# EAGLE design edge-connector-hack (EAGLE 9.4.1)
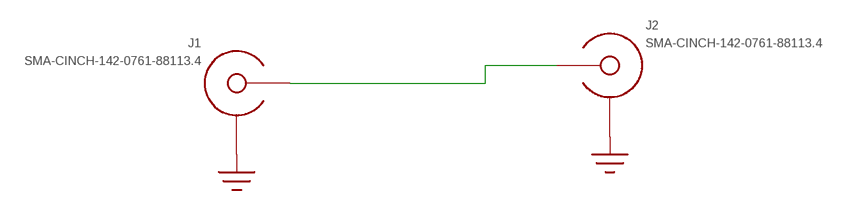
[diagram p0: schematic, sheet 1]

## Parts
J1  SMA-CINCH-142-0761-88113.4  [SMA-CINCH-142-0761-881-13.4]
J2  SMA-CINCH-142-0761-88113.4  [SMA-CINCH-142-0761-881-13.4]

## Nets
GND: J1.GND@1(SHIELD) J1.GND@2(SHIELD) J1.GND@3(SHIELD) J1.HOLE@1(SHIELD) J1.HOLE@2(SHIELD) J1.HOLE@3(SHIELD) J1.HOLE@4(SHIELD) J1.VIA@1(SHIELD) J1.VIA@2(SHIELD) J1.VIA@3(SHIELD) J1.VIA@4(SHIELD) J1.VIA@5(SHIELD) J1.VIA@6(SHIELD) J2.GND@1(SHIELD) J2.GND@2(SHIELD) J2.GND@3(SHIELD) J2.HOLE@1(SHIELD) J2.HOLE@2(SHIELD) J2.HOLE@3(SHIELD) J2.HOLE@4(SHIELD) J2.VIA@1(SHIELD) J2.VIA@2(SHIELD) J2.VIA@3(SHIELD) J2.VIA@4(SHIELD) J2.VIA@5(SHIELD) J2.VIA@6(SHIELD)
N$1 [13.6-6]: J1.CENTER J2.CENTER

## Library data of the parts
J1 J2 = yapo:SMA-CINCH-142-0761-881

## Net classes
1 13.6-6: width 0.345 mm, clearance 0.152 mm

## Board
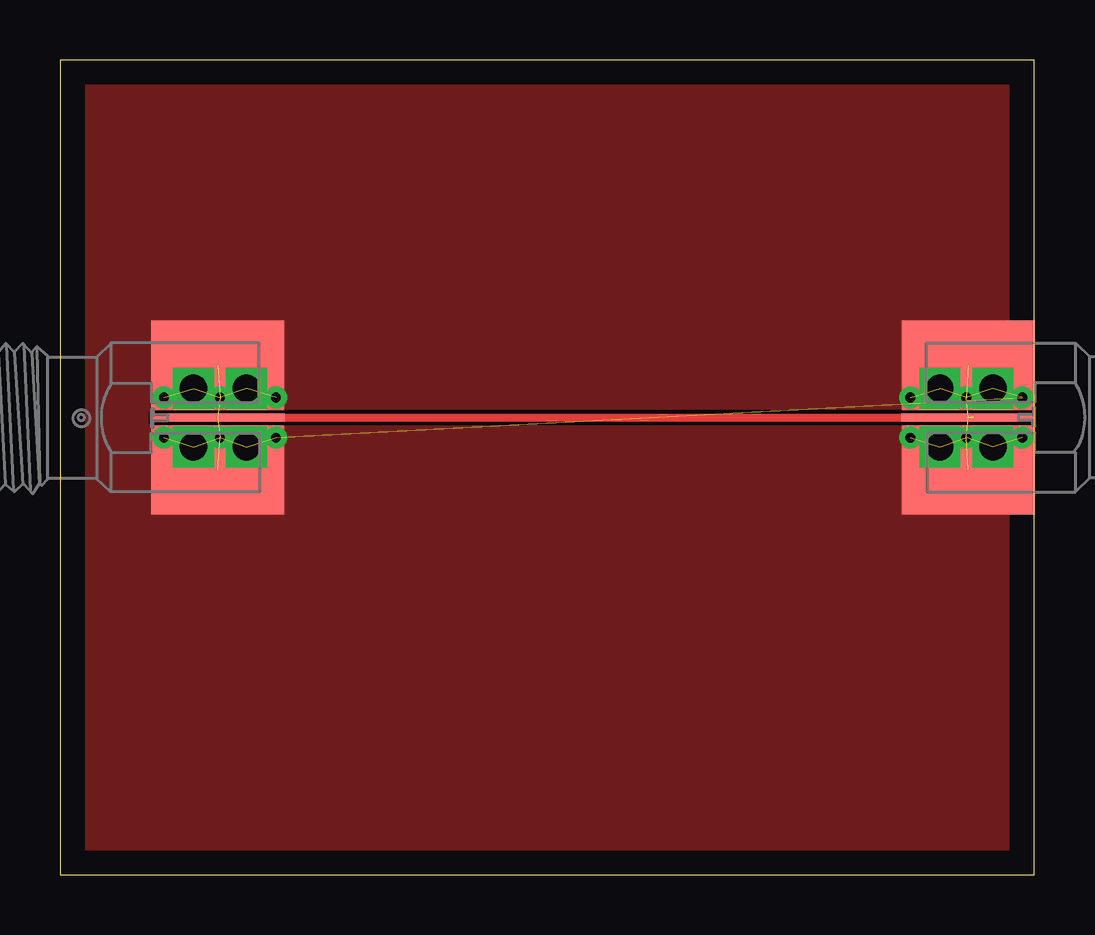
[diagram p1: board, top side]
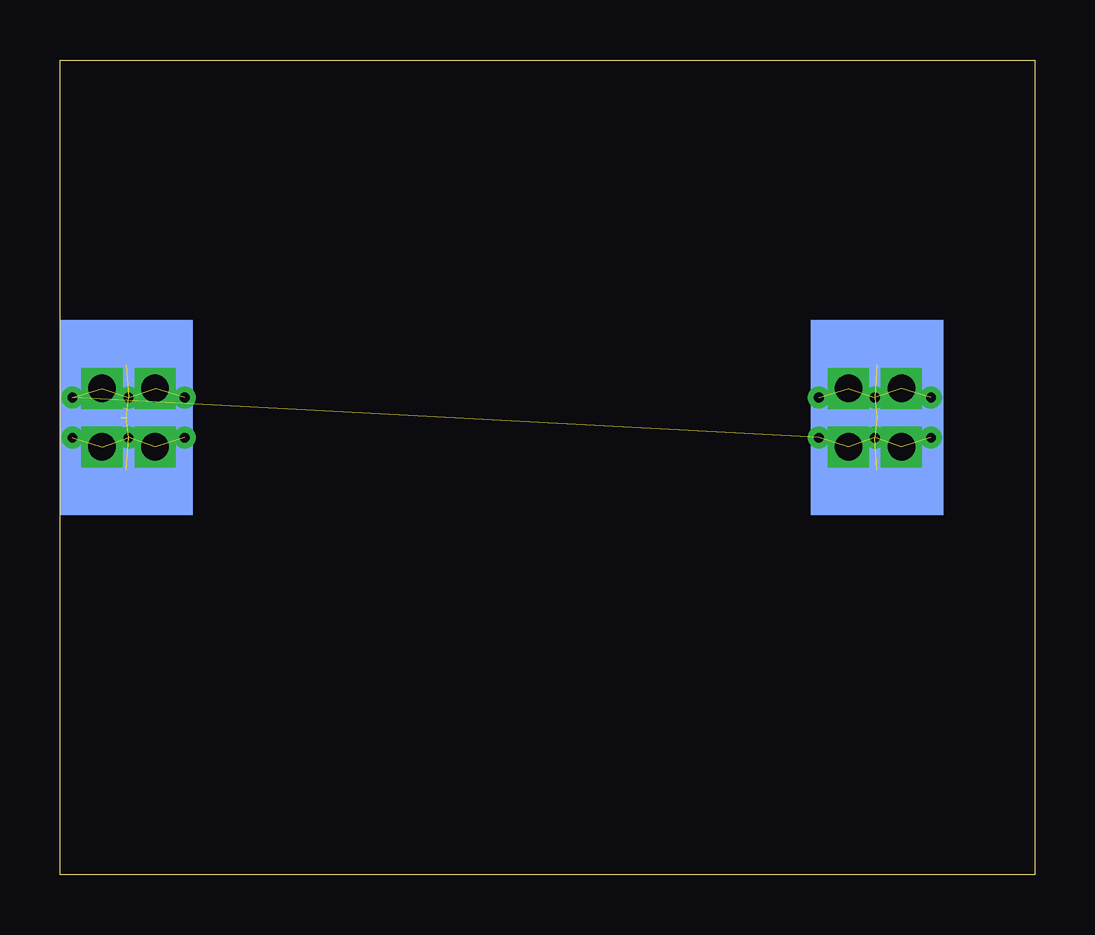
[diagram p2: board, bottom side, seen from below]

Size 40.62 x 33.96 mm. Coordinates in mm from the lower left corner, seen from the top.
Outline: 0,0 40.62,0 40.62,33.96 0,33.96 0,0
Copper layers (1*16): Top 0.035mm / dielectric 1.5mm / Bottom 0.035mm
Design rules "default": minimum track width 6mil, minimum drill 0.35mm, track to track 6mil, track to pad 6mil, pad to pad 6mil, via to via 6mil, smd to smd 6mil, copper to edge 40mil, drill to drill 6mil, minimum pad ring 10mil, minimum via ring 8mil, stop-mask expansion 4mil, vias tented up to drill 0mil, thermal gap 10mil

### Footprints (pad centres in the part's own frame; a part is rotated, then mirrored left to right if it is on the bottom)
SMA-CINCH-142-0761-881-13.4 = smd 0.34 x 5.537: CENTER 0,-2.794 | smd 3.724 x 5.537: GND@1 -2.184,-2.769; GND@2 2.184,-2.769 | smd 8.128 x 5.537 bottom: GND@3 0,-2.769 | drill 1.143 pad 1.422 square: HOLE@1 -1.219,-3.962; HOLE@2 1.219,-3.962; HOLE@3 1.219,-1.753; HOLE@4 -1.219,-1.753 | drill 0.406 pad 0.61: VIA@1 -0.838,-5.194; VIA@2 0.838,-5.194; VIA@3 0.838,-2.857; VIA@4 0.838,-0.521; VIA@5 -0.838,-0.521; VIA@6 -0.838,-2.857

### Placement (x,y rotation side)
J1  40.64,19.05 270 top
J2  3.81,19.05 90 top

### Tracks (layer width: path | path; a pad name or v marks a point on that pad's centre or on a via)
GND  (25 unrouted)
  pour Top (no thermals): 0,0 40.64,0 40.64,34.29 0,34.29
N$1  (1 unrouted)
  Top 0.34: J2.CENTER 38.1,19.05